# EAGLE design linetracer (EAGLE 9.4.2)
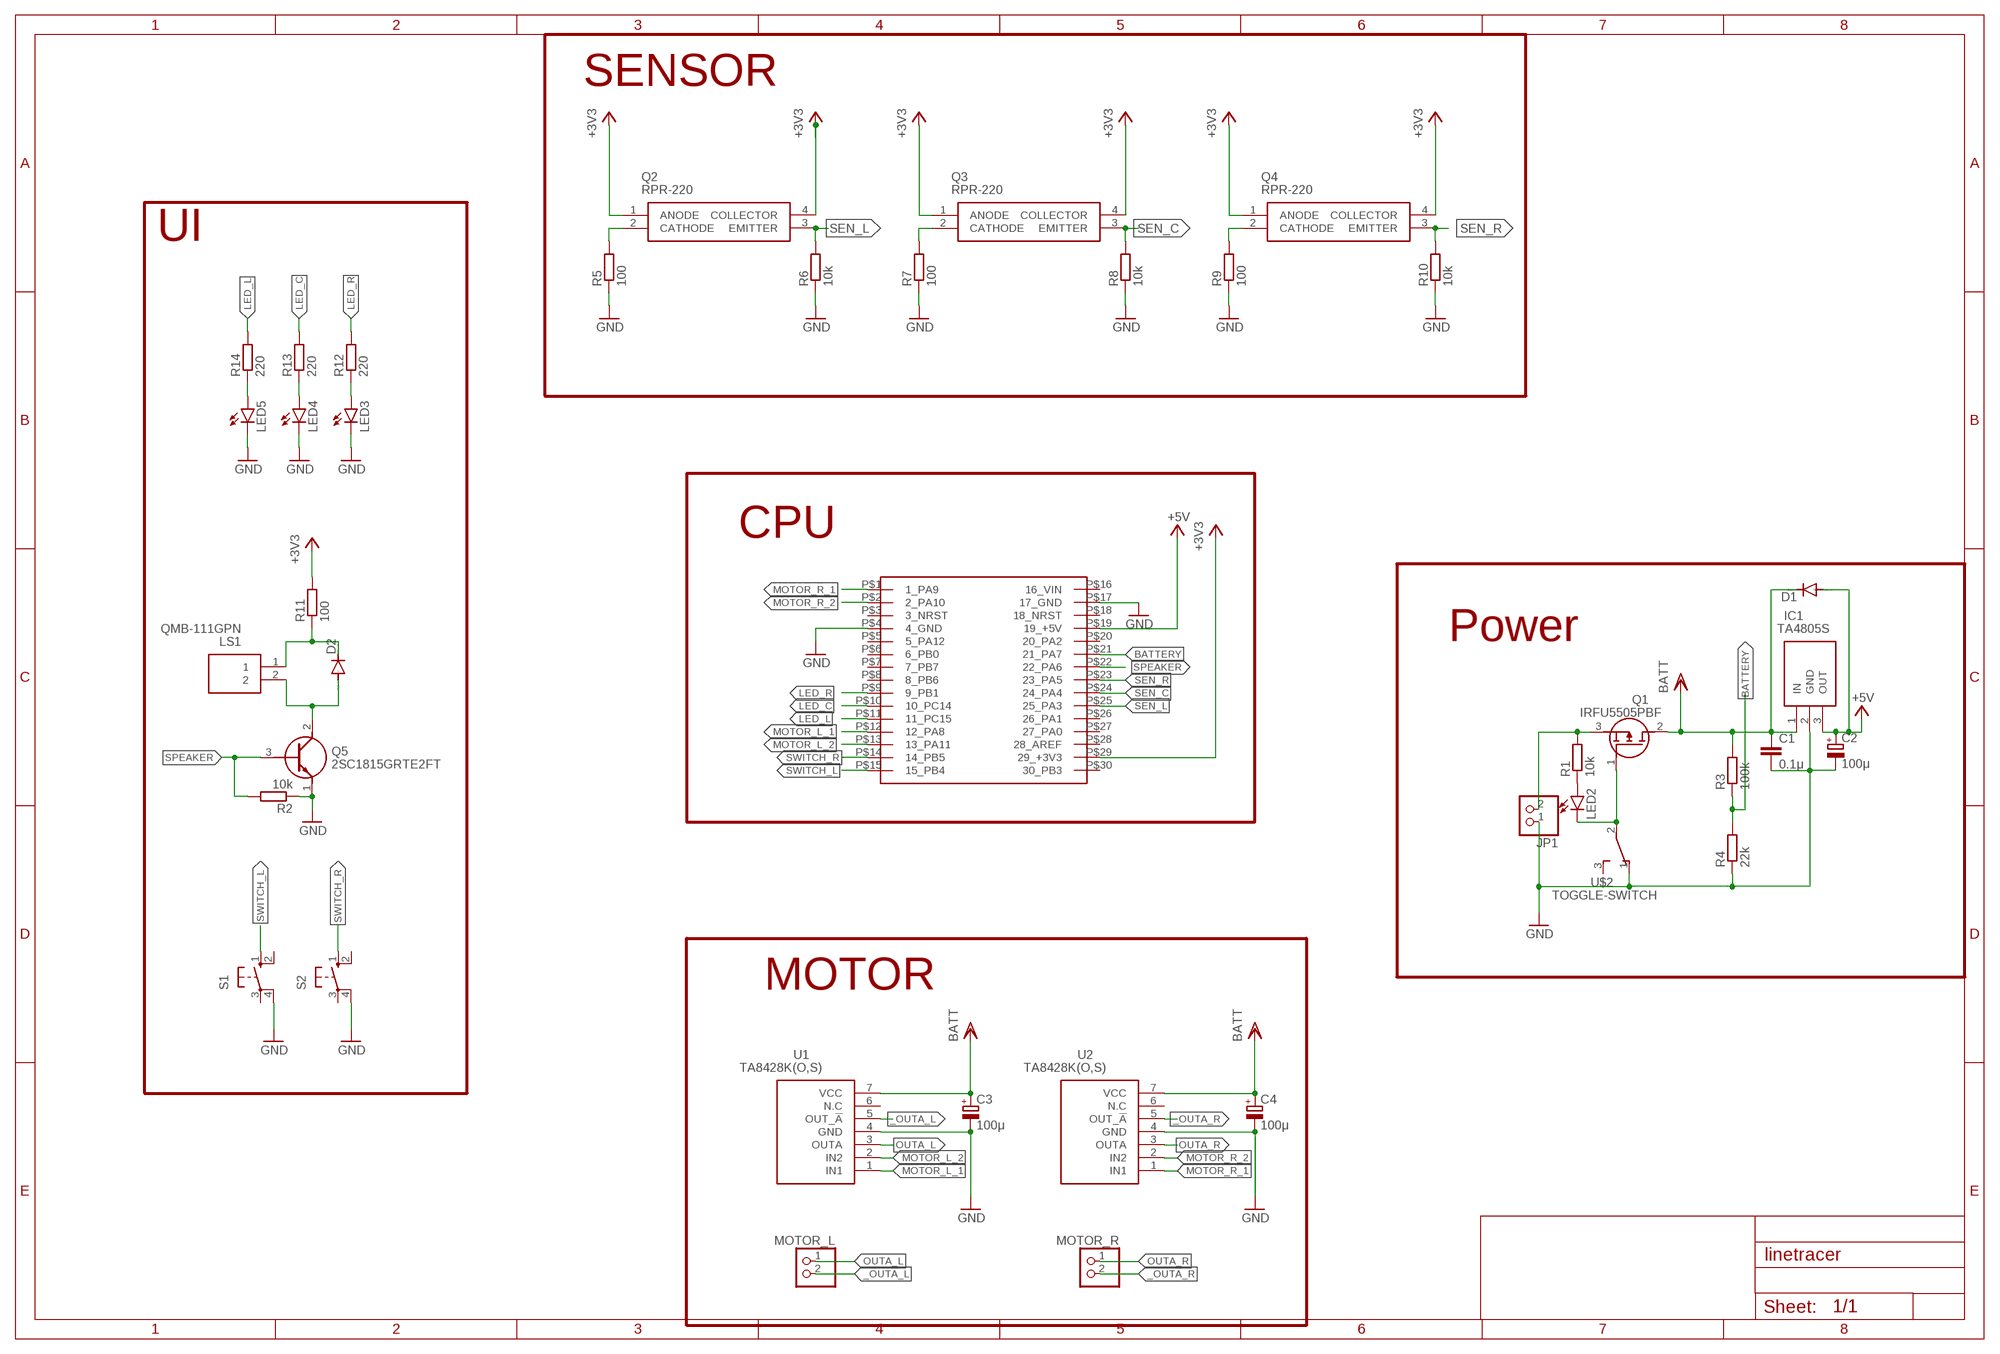
[diagram p0: schematic, sheet 1]

## Parts
C1  0.1μ  C-EU025-024X044  [C025-024X044]
C2  100μ  CPOL-EUE2.5-7  [E2,5-7]
C3  100μ  CPOL-EUE2.5-7  [E2,5-7]
C4  100μ  CPOL-EUE2.5-7  [E2,5-7]
D1  DIODE-D-2.5  [D-2.5]
D2  DIODE-D-2.5  [D-2.5]
IC1  TA4805S  [TO230P250X680X1080-3P]
JP1  PINHD-1X2  [1X02]
LED2  LED3MM  [LED3MM]
LED3  LED3MM  [LED3MM]
LED4  LED3MM  [LED3MM]
LED5  LED3MM  [LED3MM]
LS1  QMB-111GPN  [QMB111GPN]
MOTOR_L  PINHD-1X2  [1X02]
MOTOR_R  PINHD-1X2  [1X02]
Q1  IRFU5505PBF  [TO229P239X654X978-3P]
Q2  RPR-220  [RPR-220]
Q3  RPR-220  [RPR-220]
Q4  RPR-220  [RPR-220]
Q5  2SC1815GRTE2FT  [2-5F1B]
R1  10k  R-EU_0204/2V  [0204V]
R2  10k  R-EU_0204/2V  [0204V]
R3  100k  R-EU_0204/2V  [0204V]
R4  22k  R-EU_0204/2V  [0204V]
R5  100  R-EU_0204/2V  [0204V]
R6  10k  R-EU_0204/2V  [0204V]
R7  100  R-EU_0204/2V  [0204V]
R8  10k  R-EU_0204/2V  [0204V]
R9  100  R-EU_0204/2V  [0204V]
R10  10k  R-EU_0204/2V  [0204V]
R11  100  R-EU_0204/2V  [0204V]
R12  220  R-EU_0204/2V  [0204V]
R13  220  R-EU_0204/2V  [0204V]
R14  220  R-EU_0204/2V  [0204V]
S1  10-XX  [B3F-10XX]
S2  10-XX  [B3F-10XX]
U1  TA8428K(O,S)  [HSIP7-P-2.54_1]
U2  TA8428K(O,S)  [HSIP7-P-2.54_1]
U$1  NUCLEO_L432KC  [NUCLEO_L432KC]
U$2  TOGGLE-SWITCH  [1X03]

## Nets
+3V3: Q2.1(ANODE) Q2.4(COLLECTOR) Q3.1(ANODE) Q3.4(COLLECTOR) Q4.1(ANODE) Q4.4(COLLECTOR) R11.2 U$1.P$29(29_+3V3)
+5V: C2.+ D1.A IC1.3(OUT) U$1.P$19(19_+5V)
_OUTA_L: MOTOR_L.2 U1.5(OUT_!A)
_OUTA_R: MOTOR_R.2 U2.5(OUT_!A)
BATT: C1.1 C3.+ C4.+ D1.C IC1.1(IN) Q1.2(D) R3.2 U1.7(VCC) U2.7(VCC)
BATTERY: R3.1 R4.2 U$1.P$21(21_PA7)
GND: C1.2 C2.- C3.- C4.- IC1.2(GND) JP1.1 LED3.K(C) LED4.K(C) LED5.K(C) Q5.1(E) R2.1 R4.1 R5.1 R6.1 R7.1 R8.1 R9.1 R10.1 S1.4(P1) S2.4(P1) U1.4(GND) U2.4(GND) U$1.P$4(4_GND) U$1.P$17(17_GND) U$2.1
LED_C: R13.2 U$1.P$10(10_PC14)
LED_L: R14.2 U$1.P$11(11_PC15)
LED_R: R12.2 U$1.P$9(9_PB1)
MOTOR_L_1: U1.1(IN1) U$1.P$12(12_PA8)
MOTOR_L_2: U1.2(IN2) U$1.P$13(13_PA11)
MOTOR_R_1: U2.1(IN1) U$1.P$1(1_PA9)
MOTOR_R_2: U2.2(IN2) U$1.P$2(2_PA10)
N$1: JP1.2 Q1.3(S) R1.2
N$2: LED2.K(C) Q1.1(G) U$2.2
N$3: LED2.A R1.1
N$4: D2.C LS1.1 R11.1
N$6: Q2.2(CATHODE) R5.2
N$7: Q3.2(CATHODE) R7.2
N$8: Q4.2(CATHODE) R9.2
N$9: D2.A LS1.2 Q5.2(C)
N$10: LED3.A R12.1
N$11: LED4.A R13.1
N$12: LED5.A R14.1
OUTA_L: MOTOR_L.1 U1.3(OUTA)
OUTA_R: MOTOR_R.1 U2.3(OUTA)
SEN_C: Q3.3(EMITTER) R8.2 U$1.P$24(24_PA4)
SEN_L: Q2.3(EMITTER) R6.2 U$1.P$25(25_PA3)
SEN_R: Q4.3(EMITTER) R10.2 U$1.P$23(23_PA5)
SPEAKER: Q5.3(B) R2.2 U$1.P$22(22_PA6)
SWITCH_L: S1.1(S) U$1.P$15(15_PB4)
SWITCH_R: S2.1(S) U$1.P$14(14_PB5)
Unconnected: S1.2(S1) S1.3(P) S2.2(S1) S2.3(P) U1.6(N.C) U2.6(N.C) U$1.P$3(3_NRST) U$1.P$5(5_PA12) U$1.P$6(6_PB0) U$1.P$7(7_PB7) U$1.P$8(8_PB6) U$1.P$18(18_NRST) U$1.P$20(20_PA2) U$1.P$26(26_PA1) U$1.P$27(27_PA0) U$1.P$28(28_AREF) U$1.P$30(30_PB3) U$2.3

## Notes on the sheet
- SENSOR
- UI
- CPU
- Power
- MOTOR

## Power pins joined to a net without a drawn wire
16_VIN: U$1.P$16(16_VIN)

## Library data of the parts
C1 = rcl:C-EU: CAPACITOR, European symbol; SPICEPREFIX: C
C2-C4 = rcl:CPOL-EU: POLARIZED CAPACITOR, European symbol; SPICEPREFIX: C
D1 D2 = diode:DIODE-: DIODE
IC1 = TA4805S:TA4805S: Bipolar linear IC Source: Datasheet <http://html.alldatasheet.com/html-pdf/215569/TOSHIBA/TA4805F/294/1/TA4805F.html>; DESCRIPTION: Bipolar linear IC; HEIGHT: 2.5mm; MANUFACTURER_NAME: Toshiba; MANUFACTURER_PART_NUMBER: TA4805F
JP1 MOTOR_L MOTOR_R = pinhead:PINHD-1X2: PIN HEADER
LED2-LED5 = led:LED: LED OSRAM: - CHIPLED LG R971, LG N971, LY N971, LG Q971, LY Q971, LO R971, LY R971 LH N974, LH R974 LS Q976, LO Q976, LY Q976 LO Q996 - Hyper CHIPLED LW Q18S LB Q993, LB Q99A, LB R99A - SideLED LS A670, LO A670, LY A670, LG A670, LP A670 LB A673, LV A673, LT A673, LW A673 LH A674 LY A675 LS A676, LA A676, LO A676, LY A676, LW A676 LS A679, LY A679, LG A679 - Hyper Micro SIDELED® LS Y876, LA Y876, LO Y876, LY Y876 LT Y87S - SmartLED LW L88C, LW L88S LB L89C, LB L89S, LG L890 LS L89K, LO L89K, LY L89K LS L896, LA L896, LO L896, LY L896 - TOPLED LS T670, LO T670, LY T670, LG T670, LP T670 LSG T670, LSP T670, LSY T670, LOP T670, LYG T670 LG T671, LOG T671, LSG T671 LB T673, LV T673, LT T673, LW T673 LH T674 LS T676, LA T676, LO T676, LY T676, LB T676, LH T676, LSB T676, LW T676 LB T67C, LV T67C, LT T67C, LS T67K, LO T67K, LY T67K, LW E67C LS E67B, LA E67B, LO E67B, LY E67B, LB E67C, LV E67C, LT E67C LW T67C LS T679, LY T679, LG T679 LS T770, LO T770, LY T770, LG T770, LP T770 LB T773, LV T773, LT T773, LW T773 LH T774 LS E675, LA E675, LY E675, LS T675 LS T776, LA T776, LO T776, LY T776, LB T776 LHGB T686 LT T68C, LB T68C - Hyper Mini TOPLED® LB M676 - Mini TOPLED Santana® LG M470 LS M47K, LO M47K, LY M47K Source: http://www.osram.convergy.de LUXEON: - LUMILED® LXK2-PW12-R00, LXK2-PW12-S00, LXK2-PW14-U00, LXK2-PW14-V00 LXK2-PM12-R00, LXK2-PM12-S00, LXK2-PM14-U00 LXK2-PE12-Q00, LXK2-PE12-R00, LXK2-PE12-S00, LXK2-PE14-T00, LXK2-PE14-U00 LXK2-PB12-K00, LXK2-PB12-L00, LXK2-PB12-M00, LXK2-PB14-N00, LXK2-PB14-P00, LXK2-PB14-Q00 LXK2-PR12-L00, LXK2-PR12-M00, LXK2-PR14-Q00, LXK2-PR14-R00 LXK2-PD12-Q00, LXK2-PD12-R00, LXK2-PD12-S00 LXK2-PH12-R00, LXK2-PH12-S00 LXK2-PL12-P00, LXK2-PL12-Q00, LXK2-PL12-R00 Source: www.luxeon.com KINGBRIGHT: KA-3528ASYC Source: www.kingbright.com
LS1 = QMB-111GPN:QMB-111GPN: Magnetic Sounder Source: Datasheet <http://www.farnell.com/datasheets/49763.pdf>; DESCRIPTION: Magnetic Sounder; HEIGHT: 8.5mm; MANUFACTURER_NAME: Star Micronics LTD; MANUFACTURER_PART_NUMBER: QMB-111GPN
Q1 = IRFU5505PBF:IRFU5505PBF: INFINEON - IRFU5505PBF - MOSFET, P, -55V, -18A, I-PAK Source: Datasheet <https://www.infineon.com/dgdl/irfr5505pbf.pdf?fileId=5546d462533600a4015356358535210f>; ALLIED_NUMBER: 70017047; ALLIED_PRICE-STOCK: https://www.alliedelec.com/infineon-irfu5505pbf/70017047/; DESCRIPTION: INFINEON - IRFU5505PBF - MOSFET, P, -55V, -18A, I-PAK; HEIGHT: 2.39mm; MANUFACTURER_NAME: Infineon; MANUFACTURER_PART_NUMBER: IRFU5505PBF; MOUSER_PART_NUMBER: 942-IRFU5505PBF; MOUSER_PRICE-STOCK: https://www.mouser.com/Search/Refine.aspx?Keyword=942-IRFU5505PBF
Q2-Q4 = RPR-220:RPR-220: Reflective Photosensor IR+Transistor 6mm ROHM RPR-220 RPR, Through Hole Reflective Sensor, Phototransistor Output Source: Datasheet <http://rohmfs.rohm.com/en/products/databook/datasheet/opto/optical_sensor/photosensor/rpr-220.pdf>; DESCRIPTION: Reflective Photosensor IR+Transistor 6mm ROHM RPR-220 RPR, Through Hole Reflective Sensor, Phototransistor Output; HEIGHT: mm; MANUFACTURER_NAME: ROHM Semiconductor; MANUFACTURER_PART_NUMBER: RPR-220; MOUSER_PART_NUMBER: 755-RPR-220; MOUSER_PRICE-STOCK: https://www.mouser.com/Search/Refine.aspx?Keyword=755-RPR-220; RS_PART_NUMBER: 1246800P; RS_PRICE-STOCK: http://uk.rs-online.com/web/p/products/1246800P
Q5 = 2SC1815GRTE2FT:2SC1815GRTE2FT: Transistor Silicon NPN Epitaxial Type (PCT process) Source: Datasheet <http://media.digikey.com/pdf/Data Sheets/Toshiba PDFs/2SC1815.pdf>; DESCRIPTION: Transistor Silicon NPN Epitaxial Type (PCT process); HEIGHT: mm; MANUFACTURER_NAME: Toshiba; MANUFACTURER_PART_NUMBER: 2SC1815GRTE2FT; MOUSER_PART_NUMBER: 757-2SC1815GRTE2FT; MOUSER_PRICE-STOCK: https://www.mouser.com/Search/Refine.aspx?Keyword=757-2SC1815GRTE2FT
R1-R14 = rcl:R-EU_: RESISTOR, European symbol; SPICEPREFIX: R
S1 S2 = switch-omron:10-XX: OMRON SWITCH; MPN: B3F-1000; OC_FARNELL: 176432; OC_NEWARK: 36M3542
U1 U2 = TA8428K(O_S):TA8428K(O,S): Moter Driver,Full Brdg Driver,HSIP7 TA8428K(O,S), Motor Driver, Full Bridge Motor, Maximum of 30 V, 7-Pin SIP Source: Datasheet <https://toshiba.semicon-storage.com/info/docget.jsp?did=8558&prodName=TA8428K>; DESCRIPTION: Moter Driver,Full Brdg Driver,HSIP7 TA8428K(O,S), Motor Driver, Full Bridge Motor, Maximum of 30 V, 7-Pin SIP; HEIGHT: mm; MANUFACTURER_NAME: Toshiba; MANUFACTURER_PART_NUMBER: TA8428K(O,S); MOUSER_PART_NUMBER: 757-TA8428KOS; MOUSER_PRICE-STOCK: https://www.mouser.com/Search/Refine.aspx?Keyword=757-TA8428KOS; RS_PART_NUMBER: 6939336; RS_PRICE-STOCK: http://uk.rs-online.com/web/p/products/6939336
U$1 = nucleo32.Ibr:NUCLEO_L432KC
U$2 = toggle-switch:TOGGLE-SWITCH

## Board
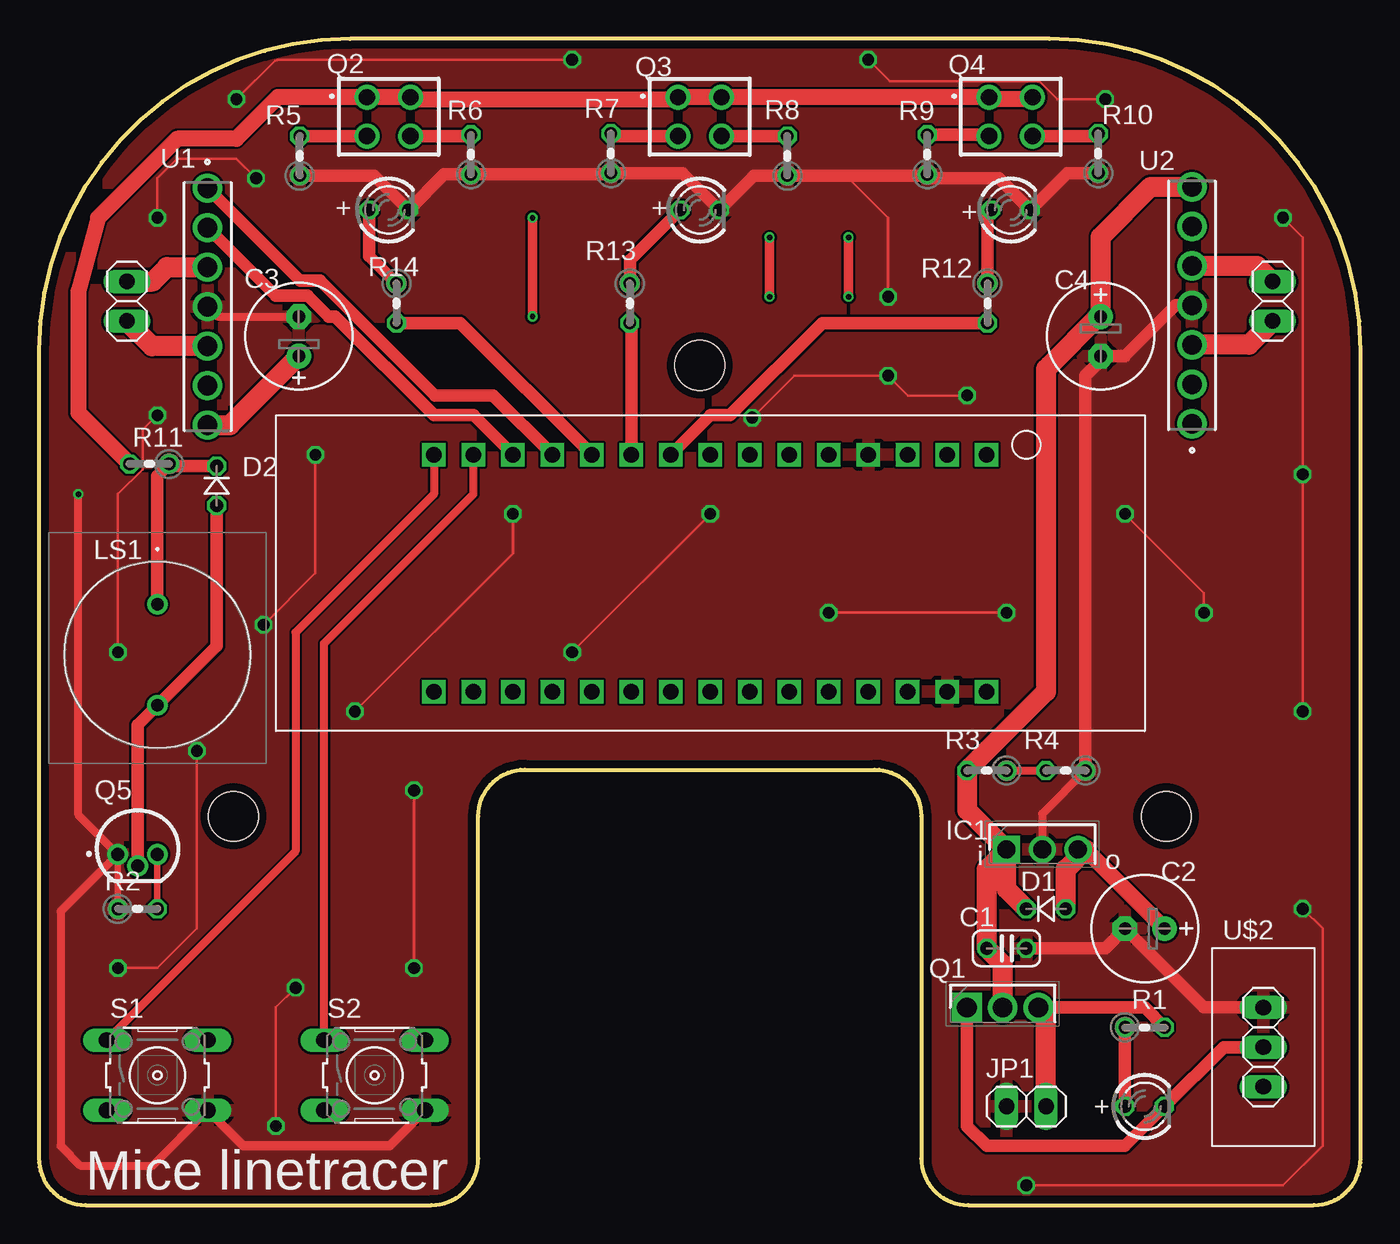
[diagram p1: board, top side]
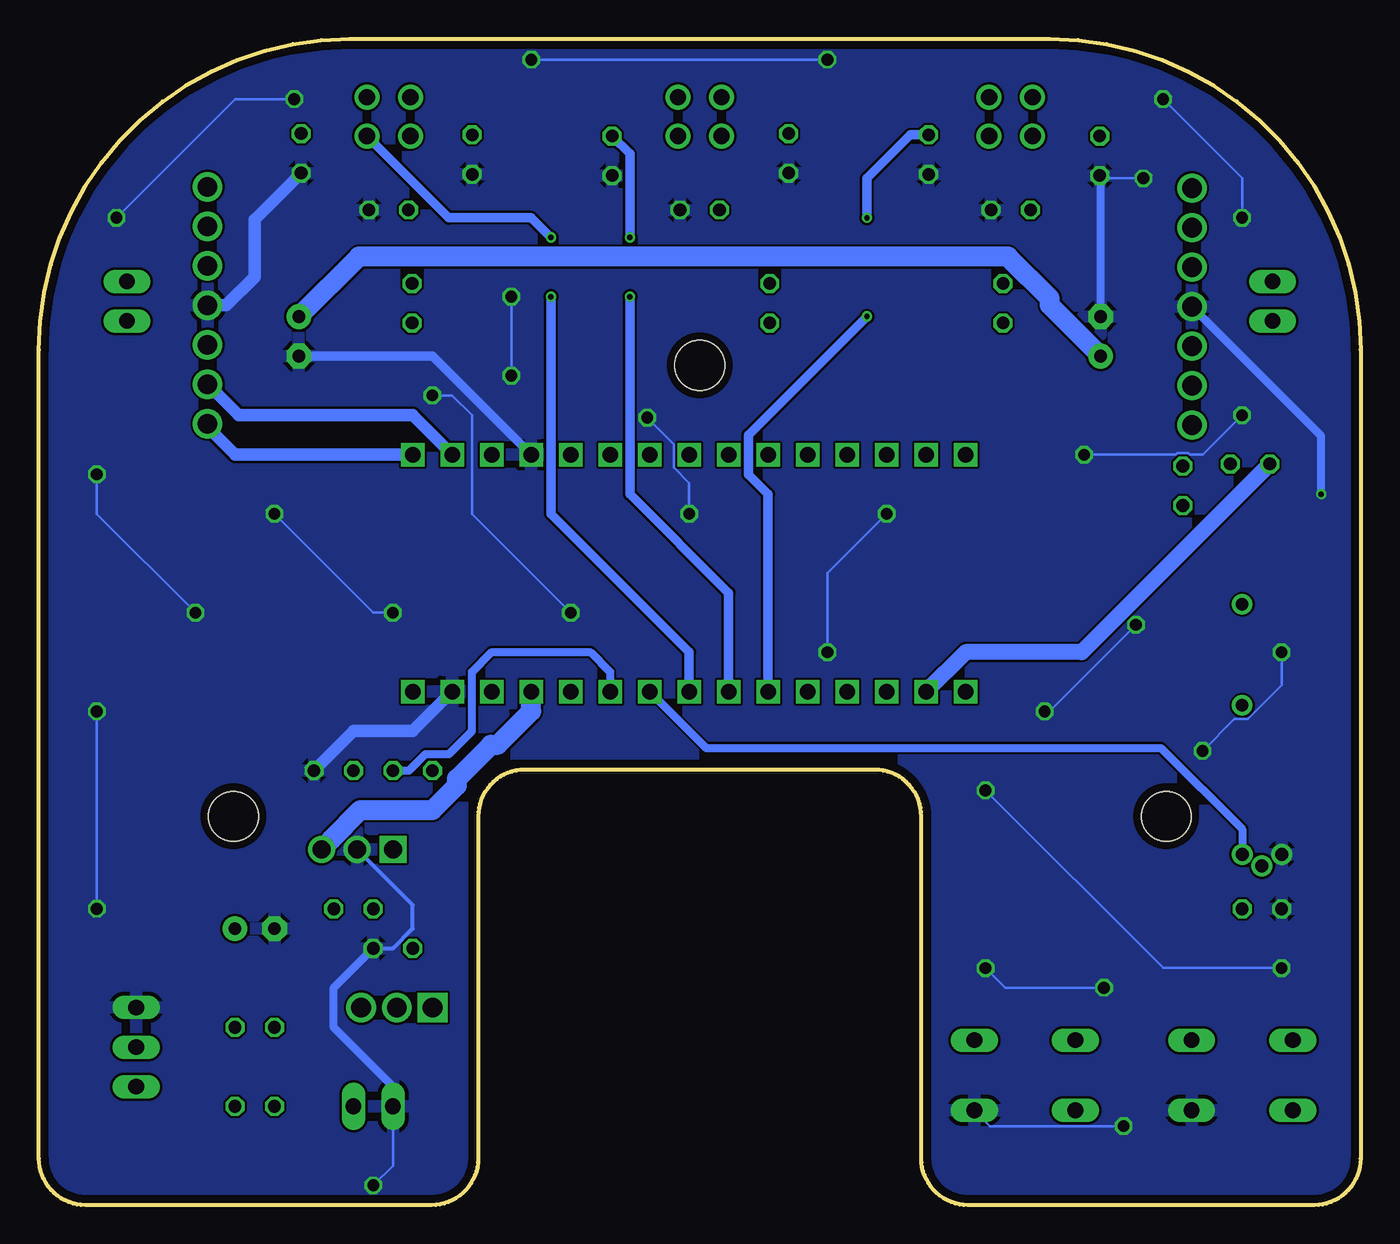
[diagram p2: board, bottom side, seen from below]

Size 85 x 75 mm. Coordinates in mm from the lower left corner, seen from the top.
Outline: 56.75,25 56.75,3 arc90 59.75,0 82,0 arc90 85,3 85,55 arc90 65,75 20,75 arc90 0,55 0,3 arc90 3,0 25.25,0 arc90 28.25,3 28.25,25 arc-90 31.25,28 53.75,28 arc-90 56.75,25
Copper layers (1*16): Top 0.035mm / dielectric 1.6mm / Bottom 0.035mm
Design rules "Elecrow_2-layer_PCB_eagle_rule": minimum track width 6mil, minimum drill 12mil, track to track 6mil, track to pad 6mil, pad to pad 6mil, via to via 8mil, smd to smd 0mil, copper to edge 20mil, drill to drill 10mil, minimum pad ring 6mil, minimum via ring 6mil, stop-mask expansion 0mil, vias tented up to drill 100mil, thermal gap 10mil
Holes 3.2 mm at 42.5,54 72.5,25 12.5,25

### Footprints (pad centres in the part's own frame; a part is rotated, then mirrored left to right if it is on the bottom)
C025-024X044 = drill 0.813 octagon: 1 -1.27,0; 2 1.27,0
E2,5-7 = drill 0.813 pad 1.6: + -1.27,0 | drill 0.813 pad 1.6 octagon: - 1.27,0
D-2.5 = drill 0.813 octagon: A 1.27,0; C -1.27,0
TO230P250X680X1080-3P = drill 1.16 pad 1.74 square: 1 0,0 | drill 1.16 pad 1.74: 2 2.3,0; 3 4.6,0
1X02 = drill 1.016 long: 1 -1.27,0; 2 1.27,0
LED3MM = drill 0.813 octagon: A -1.27,0; K 1.27,0
QMB111GPN = drill 0.8 pad 1.3: 1 0,0; 2 0,6.5
TO229P239X654X978-3P = drill 1.28 pad 1.92 square: 1 0,0 | drill 1.28 pad 1.92: 2 2.29,0; 3 4.58,0
RPR-220 = drill 1.05 pad 1.6: 1 -1.4,1.25; 2 -1.4,-1.25; 3 1.4,-1.25; 4 1.4,1.25
2-5F1B = drill 0.84 pad 1.34: 1 -1.27,1.7; 2 0,0.95; 3 1.27,1.7
0204V = drill 0.813 octagon: 1 -1.27,0; 2 1.27,0
B3F-10XX = drill 1.016 long: 1 -3.251,2.261; 2 3.251,2.261; 3 -3.251,-2.261; 4 3.251,-2.261
HSIP7-P-2.54_1 = drill 1.26 pad 1.86: 1 -7.62,0; 2 -5.08,0; 3 -2.54,0; 4 0,0; 5 2.54,0; 6 5.08,0; 7 7.62,0
NUCLEO_L432KC = drill 1 square: P$1 2.54,-2.54; P$2 2.54,-5.08; P$3 2.54,-7.62; P$4 2.54,-10.16; P$5 2.54,-12.7; P$6 2.54,-15.24; P$7 2.54,-17.78; P$8 2.54,-20.32; P$9 2.54,-22.86; P$10 2.54,-25.4; P$11 2.54,-27.94; P$12 2.54,-30.48; P$13 2.54,-33.02; P$14 2.54,-35.56; P$15 2.54,-38.1; P$16 17.78,-2.54; P$17 17.78,-5.08; P$18 17.78,-7.62; P$19 17.78,-10.16; P$20 17.78,-12.7; P$21 17.78,-15.24; P$22 17.78,-17.78; P$23 17.78,-20.32; P$24 17.78,-22.86; P$25 17.78,-25.4; P$26 17.78,-27.94; P$27 17.78,-30.48; P$28 17.78,-33.02; P$29 17.78,-35.56; P$30 17.78,-38.1
1X03 = drill 1.016 long: 1 -2.54,0; 2 0,0; 3 2.54,0

### Placement (x,y rotation side)
C1  62.23,16.51 0 top
C2  71.12,17.78 180 top
C3  16.72,55.87 90 top
C4  68.28,55.87 270 top
D1  64.77,19.05 0 top
D2  11.43,46.26 270 top
IC1  62.23,22.86 0 top
JP1  63.5,6.35 0 top
LED2  71.12,6.35 0 top
LED3  62.5,64 0 top
LED4  42.5,64 0 top
LED5  22.5,64 0 top
LS1  7.62,38.64 180 top
MOTOR_L  5.66,58.13 270 top
MOTOR_R  79.34,58.13 90 top
Q1  59.69,12.7 0 top
Q2  22.5,70 0 top
Q3  42.5,70 0 top
Q4  62.5,70 0 top
Q5  6.35,20.86 0 top
R1  71.12,11.43 0 top
R2  6.35,19.05 0 top
R3  60.96,27.94 180 top
R4  66.04,27.94 180 top
R5  16.78,67.48 90 top
R6  27.78,67.56 90 top
R7  36.78,67.64 90 top
R8  48.13,67.48 90 top
R9  57.13,67.56 90 top
R10  68.13,67.64 90 top
R11  7.11,47.66 180 top
R12  61,58 270 top
R13  38,58 270 top
R14  23,58 270 top
S1  7.62,8.35 0 top
S2  21.59,8.35 0 top
U1  10.85,57.78 270 top
U2  74.15,57.87 90 top
U$1  63.5,50.8 270 top
U$2  78.74,10.16 270 top

### Tracks (layer width: path | path; a pad name or v marks a point on that pad's centre or on a via)
+3V3
  Top 0.61: Q2.4 24,71.25 24.13,71.12
  Top 1.016: Q4.4 63.77,71.12 60.96,71.12 Q4.1 Q3.4 Q3.1 40.97,71.12 24.13,71.12 | Q2.4 Q2.1 15.37,71.25 12.7,68.58 8.89,68.58 3.81,63.5 2.54,58.76 2.54,50.96 R11.2
  Bottom 1.016: R11.2 17.94,35.56 25.4,35.56 U$1.P$29
+5V
  Top 1.016: C2.+ 67.31,22.86 IC1.3
  Top 1.27: D1.A 66.04,21.59 67.31,22.86
  Bottom 1.27: IC1.3 66.19,23.5 66.19,23.55 64.33,25.4 59.69,25.4 58.12,26.97 58.12,27.42 55.93,29.6 55.49,29.6 53.34,31.75 U$1.P$19
_OUTA_L
  Top 1.27: U1.5 7.28,55.24 MOTOR_L.2
_OUTA_R
  Top 1.27: U2.5 78.33,60.41 MOTOR_R.2
BATT
  Top 1.016: 65,54 64.77,53.77
  Top 1.27: Q1.2 61.98,15.49 C1.1 60.96,21.59 IC1.1 | 65,54 68.14,57.14 C4.+ 68.28,62.28 71.49,65.49 U2.7 | U1.7 12.28,50.16 C3.+ | 64.77,53.77 64.77,33.02 R3.2 59.69,25.4 IC1.1 | D1.C 62.23,20.32 IC1.1
  Bottom 1.27: C3.+ 20,57.88 20,58.32 22.68,61 64.42,61 C4.+
BATTERY
  Top 0.508: R3.1 R4.2
  Bottom 0.508: R3.1 61.2,27.94 60.13,29.01 58.62,29.01 57.15,30.48 57.15,34.29 55.88,35.56 49.53,35.56 48.26,34.29 U$1.P$21
GND  (via drill 0.35, 0.75)
  Top 0.152: v63.5,1.27 80.01,1.27 82.55,3.81 82.55,17.78 v81.28,19.05 | v81.28,31.75 v81.28,46.99 81.28,62.23 v80.01,63.5 | v74.93,38.1 74.93,39.37 v69.85,44.45 | v62.23,38.1 v50.8,38.1 | v59.69,52.07 55.88,52.07 v54.61,53.34 48.58,53.34 v45.88,50.64 | v54.61,58.42 54.61,63.5 51.9,66.21 49.53,66.21 | v68.58,71.12 65.48,71.12 64.33,72.28 54.72,72.28 v53.34,73.66 | v34.29,73.66 15.4,73.66 15.18,73.6 v12.7,71.12 | v7.62,63.5 7.62,66.04 8.89,67.31 12.7,67.31 v13.97,66.04 | v15.24,5.08 15.24,12.7 v16.51,13.97 | v24.13,15.24 v24.13,26.67 | v5.08,15.24 7.62,15.24 10.16,17.78 v10.16,29.21 | v5.08,35.56 5.08,45.72 6.68,47.31 6.68,49.86 v7.62,50.8 | v17.78,48.26 17.78,40.64 v14.46,37.31 | v20.32,31.75 30.48,41.91 v30.48,44.45 | v34.29,35.56 v43.18,44.45
  Top 0.406: R2.1 Q5.1
  Top 0.508: IC1.2 64.53,25.16 R4.1 | S1.4 7.32,2.54 2.67,2.54 1.4,3.81 1.4,18.88 Q5.1 2.54,25.1 v2.54,45.72 | U1.4 11.49,57.14 C3.-
  Top 0.61: S1.4 13.15,3.81 22.56,3.81 S2.4 | C4.- 69.84,54.6 69.85,54.61
  Top 0.813: U$2.1 74.93,12.7 C2.- 68.58,16.51 C1.2 | R5.1 21.56,66.21 LED5.K 26.06,66.29 R6.1 36.7,66.29 R7.1 41.4,66.37 LED4.K 45.98,66.21 R8.1 49.53,66.21 57.05,66.21 R9.1 57.38,66.04 61.73,66.04 LED3.K 66.14,66.37 R10.1 | U2.4 73.11,57.87 69.85,54.61 68.58,54.61 67.31,53.34 R4.1
  Bottom 0.152: JP1.1 62.23,2.54 v63.5,1.27 | v81.28,46.99 81.28,44.45 v74.93,38.1 | v69.85,44.45 63.5,38.1 v62.23,38.1 | v50.8,38.1 57.15,44.45 57.15,50.8 58.42,52.07 v59.69,52.07 | v54.61,53.34 v54.61,58.42 | v81.28,19.05 v81.28,31.75 | v80.01,63.5 72.39,71.12 v68.58,71.12 | v53.34,73.66 v34.29,73.66 | v12.7,71.12 7.62,66.04 v7.62,63.5 | v13.97,66.04 16.61,66.04 16.72,66.15 | S2.4 23.83,5.08 v15.24,5.08 | v16.51,13.97 22.86,13.97 v24.13,15.24 | v24.13,26.67 12.7,15.24 v5.08,15.24 | v10.16,29.21 8.11,31.26 7.26,31.26 5.08,33.44 v5.08,35.56 | v7.62,50.8 10.16,48.26 10.97,48.26 11.08,48.37 11.78,48.37 11.88,48.26 v17.78,48.26 | v14.46,37.31 20.02,31.75 v20.32,31.75 | v30.48,44.45 34.29,40.64 v34.29,35.56 | v45.88,50.64 44.16,48.92 44.16,47.41 43.18,46.44 v43.18,44.45
  Bottom 0.254: C1.2 62.23,16.51 60.96,17.78 60.96,19.29 IC1.2
  Bottom 0.508: JP1.1 62.23,7.62 66.04,11.43 66.04,13.97 C1.2 | v2.54,45.72 2.54,49.47 U1.4 | C3.- 16.72,66.15 R5.1
  Bottom 0.61: U$1.P$4 59.68,54.6 C4.-
  Bottom 0.813: R10.1 71.12,63.38 71.12,59.69 72.94,57.87 U2.4 | U$1.P$17 60.96,30.48 64.77,30.48 R4.1
  pour Top: -2.54,-5.08 90.17,-5.08 91.44,-3.81 95.25,0 95.25,69.85 85.09,80.01 12.7,80.01 5.08,80.01 1.27,76.2 -2.54,72.39
  pour Bottom: -2.54,-5.08 91.44,-5.08 91.44,68.58 88.9,71.12 83.82,76.2 68.58,76.2 0,76.2 -2.54,73.66
LED_C
  Top 0.813: R13.2 38.1,56.63 U$1.P$10
LED_L
  Top 0.813: R14.2 27.09,56.73 U$1.P$11
LED_R
  Top 0.813: U$1.P$9 43.18,50.8 44.45,50.8 50.38,56.73 R12.2
MOTOR_L_1
  Top 0.813: U$1.P$12 29.21,52.07 25.5,52.07 18.1,59.46 16.79,59.46 U1.1
MOTOR_L_2
  Top 0.813: U1.2 15.21,58.5 17.28,58.5 18.63,57.15 19.05,57.15 25.4,50.8 27.94,50.8 U$1.P$13
MOTOR_R_1
  Bottom 0.813: U$1.P$1 72.39,48.26 74.15,50.02 U2.1
MOTOR_R_2
  Bottom 0.813: U2.2 72.16,50.8 60.96,50.8 U$1.P$2
N$1
  Top 0.813: R1.2 71.12,12.7 Q1.3
  Top 1.27: JP1.2 64.77,12.2 Q1.3
N$2
  Top 0.813: Q1.1 59.69,5.08 60.96,3.81 69.85,3.81 LED2.K 76.2,10.16 U$2.2
N$3
  Top 0.813: LED2.A R1.1
N$4
  Top 0.813: LS1.1 7.62,46.9 R11.1 8.51,47.53 D2.C
N$6
  Top 0.813: R5.2 Q2.2
N$7
  Top 0.813: R7.2 36.94,68.75 Q3.2
N$8
  Top 0.813: R9.2 61.02,68.83 Q4.2
N$9
  Top 0.813: Q5.2 6.35,30.87 LS1.2 11.43,35.95 D2.A
N$10
  Top 0.813: R12.1 61,63.77 LED3.A
N$11
  Top 0.813: R13.1 38,60.77 LED4.A
N$12
  Top 0.813: R14.1 21.23,61.04 LED5.A
OUTA_L
  Top 1.27: MOTOR_L.1 7.33,59.4 8.25,60.32 U1.3
OUTA_R
  Top 1.27: MOTOR_R.1 77.81,55.33 U2.3
SEN_C  (via drill 0.35)
  Top 0.61: v46.99,58.42 v46.99,62.23
  Top 0.813: Q3.3 R8.2
  Bottom 0.61: U$1.P$24 40.64,39.37 46.99,45.72 v46.99,58.42 | v46.99,62.23 46.99,67.61 R8.2
SEN_L  (via drill 0.35)
  Top 0.61: v31.75,57.15 v31.75,63.5
  Top 0.813: Q2.3 27.7,68.75 R6.2
  Bottom 0.61: v31.75,63.5 31.75,66.04 28.96,68.83 R6.2 | U$1.P$25 38.1,45.72 39.37,46.99 39.37,49.53 v31.75,57.15
SEN_R  (via drill 0.35)
  Top 0.61: v52.07,58.42 v52.07,62.23
  Top 0.813: Q4.3 67.97,68.75 R10.2
  Bottom 0.61: U$1.P$23 43.18,35.56 52.07,44.45 v52.07,58.42 | v52.07,62.23 53.34,63.5 58.65,63.5 Q4.3
SPEAKER
  Top 0.406: R2.2 Q5.3
  Bottom 0.508: U$1.P$22 42.1,29.4 12.84,29.4 7.62,24.18 Q5.3
SWITCH_L
  Top 0.508: U$1.P$15 25.4,45.72 16.51,36.83 16.51,22.75 S1.1
SWITCH_R
  Top 0.508: S2.1 18.34,36.12 27.94,45.72 U$1.P$14

### Text on the board
tPlace: Mice linetracer
tNames: + | + | + | i | o | +